# Altium schematic sheet DWM3000.SchDoc
size A4; SheetNumber: 1; SheetTotal: 4
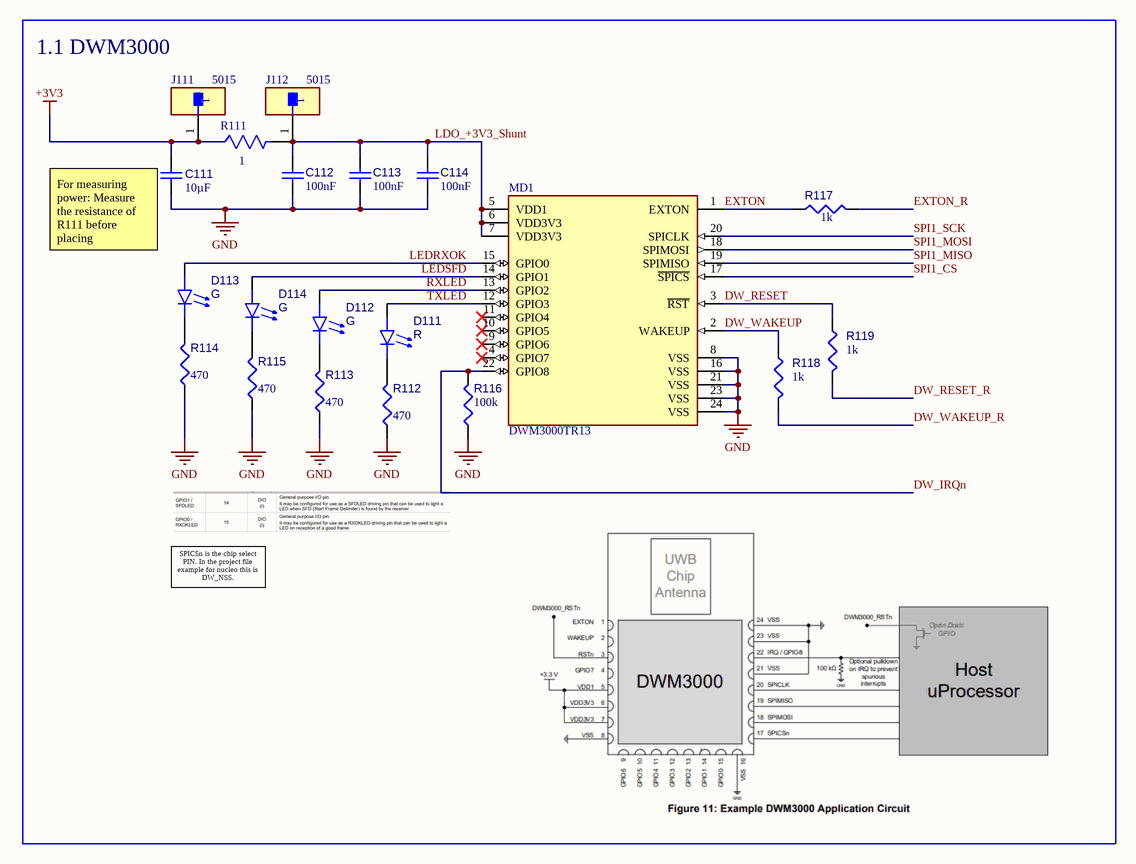
[diagram p0: DWM3000.SchDoc]

## Parts
C111  value 10µF  [CAPC0603(1608)100_L]  (hidden comment: Capacitor 10µF +/-20% 10V 0603)
C112  value 100nF  [CAPC0402(1005)60_L]  (hidden comment: Capacitor 100nF +/-20% 10V 0402)
C113  value 100nF  [CAPC0402(1005)60_L]  (hidden comment: Capacitor 100nF +/-20% 10V 0402)
C114  value 100nF  [CAPC0402(1005)60_L]  (hidden comment: Capacitor 100nF +/-20% 10V 0402)
D111  R  [WL-SMCW_0603_150060xx75000]
D112  G  [WL-SMCW_0603_150060xx75000]
D113  G  [WL-SMCW_0603_150060xx75000]
D114  G  [WL-SMCW_0603_150060xx75000]
J111  5015  [FP-5015-MFG]
J112  5015  [FP-5015-MFG]
MD1  DWM3000TR13  [FP-DWM3000TR13-MFG]
R111  value 1  [FP-CRCW0603-HPe3-MFG]  (hidden comment: CRCW06031R00FKEAHP)
R112  value 470  [RESC0805(2012)_L]  (hidden comment: Resistor 470R +/-5% 0805 125 mW)
R113  value 470  [RESC0805(2012)_L]  (hidden comment: Resistor 470R +/-5% 0805 125 mW)
R114  value 470  [RESC0805(2012)_L]  (hidden comment: Resistor 470R +/-5% 0805 125 mW)
R115  value 470  [RESC0805(2012)_L]  (hidden comment: Resistor 470R +/-5% 0805 125 mW)
R116  value 100k  [RESC1608X55X25ML10T15]  (hidden comment: Resistor 100k +/-1% 0603 100 mW)
R117  value 1k  [RESC1005X40X25ML10T10]  (hidden comment: Resistor 1k +/-5% 0402 63 mW)
R118  value 1k  [RESC1005X40X25ML10T10]  (hidden comment: Resistor 1k +/-5% 0402 63 mW)
R119  value 1k  [RESC1005X40X25ML10T10]  (hidden comment: Resistor 1k +/-5% 0402 63 mW)

## Blocks framed on the sheet
1.1 DWM3000: C111-C114 D111-D114 J111 J112 MD1 R111-R119

## Nets
+3V3: C111.1 J111.1 R111.1
GND: C111.2 C112.1 C113.1 C114.1 MD1.8(VSS) MD1.16(VSS) MD1.21(VSS) MD1.23(VSS) MD1.24(VSS) R112.1 R113.1 R114.1 R115.1 R116.1
DW_IRQn: MD1.22(GPIO8) R116.2
DW_RESET: MD1.3(~{RST}) R119.1
DW_RESET_R: R119.2
DW_WAKEUP: MD1.2(WAKEUP) R118.1
DW_WAKEUP_R: R118.2
EXTON: MD1.1(EXTON) R117.1
EXTON_R: R117.2
LDO_+3V3_Shunt: C112.2 C113.2 C114.2 J112.1 MD1.5(VDD1) MD1.6(VDD3V3) MD1.7(VDD3V3) R111.2
LEDRXOK: D113.2(A) MD1.15(GPIO0)
LEDSFD: D114.2(A) MD1.14(GPIO1)
RXLED: D112.2(A) MD1.13(GPIO2)
SPI1_CS: MD1.17(~{SPICS})
SPI1_MISO: MD1.19(SPIMISO)
SPI1_MOSI: MD1.18(SPIMOSI)
SPI1_SCK: MD1.20(SPICLK)
TXLED: D111.2(A) MD1.12(GPIO3)
NetD111_1: D111.1(K) R112.2
NetD112_1: D112.1(K) R113.2
NetD113_1: D113.1(K) R114.2
NetD114_1: D114.1(K) R115.2

Not connected (* = marked no-connect by the designer): MD1 4(GPIO7)* 9(GPIO6)* 10(GPIO5)* 11(GPIO4)*

## Notes on the sheet
- (near C111) For measuring power: Measure the resistance of R111 before placing
- SPICSn is the chip select PIN. In the project file example for nucleo this is DW_NSS.

## Library data of the parts
C111 = CMP-001-00075-4: Chip Capacitor, 10µF +/-20%, 10V, 0603, Thickness 1 mm; Tolerance: 10%; Voltage Rating: 10V; Max Operating Temperature: 85°C; Pins: 2; Case/Package: 0603; Mounting Technology: SMT; Min Operating Temperature: -55°C
C112-C114 = CMP-001-00061-3: Chip Capacitor, 100nF +/-20%, 10V, 0402, Thickness 0.6 mm; Tolerance: 20%; Mounting Technology: SMT; Voltage Rating: 10V; Max Operating Temperature: 85°C; Pins: 2; Case/Package: 0402; Min Operating Temperature: -55°C
D111 = CMP-007-00037-1: Single Color LED, Red, Water Clear, 1.1mm; RoHS Compliant: Yes; Max Operating Temperature: 85°C; Min Operating Temperature: -40°C
D112-D114 = CMP-007-00038-1: Single Color LED, Green, Water Clear, 1.1mm; Max Operating Temperature: 85°C; Min Operating Temperature: -40°C; RoHS Compliant: Yes
J111 J112 = CMP-00028-00008-1: Interconnection Device; RoHS Compliant: Yes; Connector Type: Interconnection Device; JESD-609 Code: e4; Contact Finish - Termination: Silver (Ag); Reach SVHC Compliant: Yes
MD1 = CMP-021-00007-1: UWB Transceiver Module; RoHS Compliant: Yes
R111 = CMP-009-00195-1: Fixed Resistor, Metal Glaze/thick Film, 0.33W, 1ohm, 75V, 1% +/-Tol, 100ppm/Cel, Surface Mount, 0603; Package Height: 0.45mm; Temperature Coefficient: 100ppm/°C; Package Length: 1.6mm; Reference Standard: AEC-Q200; Package Width: 0.85mm; Rated Temperature: 70°C; Power: 250mW; Pins: 2; Packaging: Tape and Reel; Package Shape: Rectangular; Mounting Technology: Surface Mount; RoHS Compliant: Yes; Resistor Type: FIXED RESISTOR; Construction: Chip; Technology: METAL GLAZE/THICK FILM; Tolerance: 1%; Max Operating Temperature: 155°C; Termination: Wraparound; Terminal Finish: Nickel; Min Operating Temperature: -55°C; Package Style: SMTMeter; Reach SVHC Compliant: Yes; Case/Package: 0603; Working Voltage: 75V; JESD-609 Code: e3
R112-R115 = CMP-009-00122-3: Chip Resistor, 470 Ohms, +/-5%, 125 mW, -55 to 155 degC, 0805; Tolerance: 5%; Power: 125mW; Max Operating Temperature: 155°C; Case/Package: 0805; Pins: 2; Min Operating Temperature: -55°C
R116 = CMP-009-00023-5: Chip Resistor, 100 KOhm, +/- 1%, 0.1 W, -55 to 155 degC, 0603 (1608 Metric); Voltage Rating: 50V; Power: 100mW; Max Operating Temperature: 155°C; RoHS Compliant: True; Tolerance: 1%; Pins: 2; Case/Package: 0603; Mounting Technology: SM; Min Operating Temperature: -55°C
R117-R119 = CMP-009-00013-5: Chip Resistor, 1 KOhm, +/- 5%, 0.063 W, -55 to 155 degC, 0402 (1005 Metric); Power: 63mW; Tolerance: 5%; Case/Package: 0402; Mounting Technology: SM; Min Operating Temperature: -55°C; Pins: 2; Max Operating Temperature: 155°C; RoHS Compliant: True